# EAGLE schematic partybooth (EAGLE 6.1)
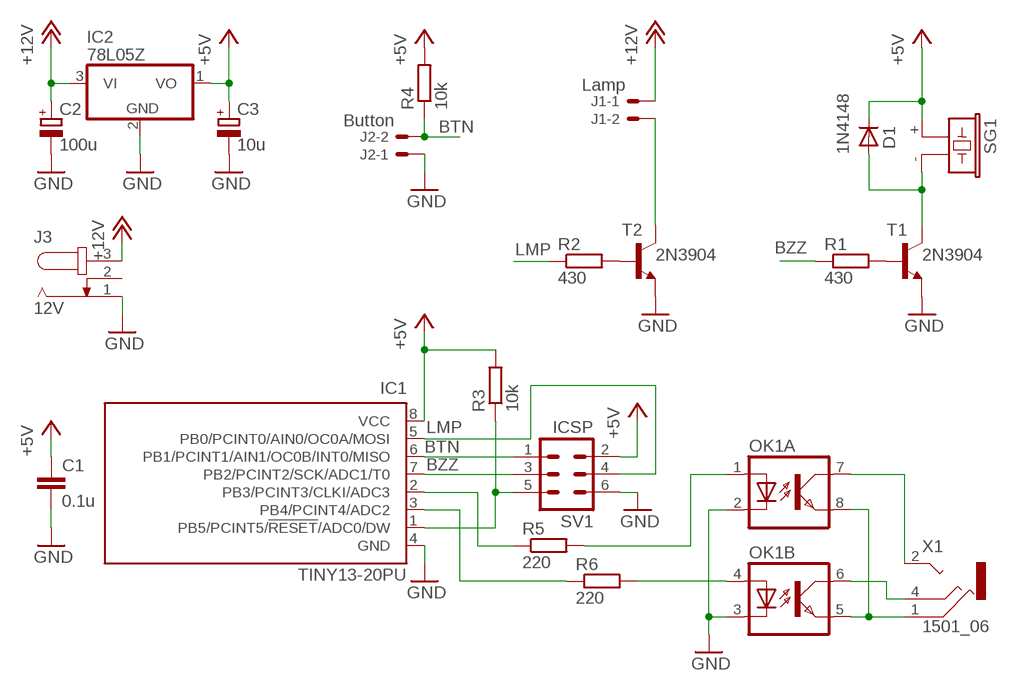
[diagram p0: schematic, sheet 1]

## Parts
C1  0.1u  C-EU050-025X075  [C050-025X075]
C2  100u  CPOL-EUB45181B  [B45181B]
C3  10u  CPOL-EUB45181B  [B45181B]
D1  1N4148  1N4148DO35-7  [DO35-7]
IC1  TINY13-20PU  [DIL08]
IC2  78L05Z  [TO92]
J1  Lamp  22-27-2021-02  [6410-02]
J2  Button  22-27-2021-02  [6410-02]
J3  12V  JACK-PLUG0  [SPC4077]
OK1  ILD2  [DIL08]
R1  430  R-EU_0204/7  [0204/7]
R2  430  R-EU_0204/7  [0204/7]
R3  10k  R-EU_0204/7  [0204/7]
R4  10k  R-EU_0204/7  [0204/7]
R5  220  R-EU_0204/7  [0204/7]
R6  220  R-EU_0204/7  [0204/7]
SG1  F/CM12P  [F/CM12P]
SV1  ICSP  MA03-2  [MA03-2]
T1  2N3904  [TO92]
T2  2N3904  [TO92]
X1  1501_06  [1501_06]

## Nets
+5V: C1.1 C3.+ D1.C IC1.8(VCC) IC2.1(VO) R3.2 R4.2 SG1.+ SV1.2
+12V: C2.+ IC2.3(VI) J1.1 J3.3
BTN: IC1.6(PB1/PCINT1/AIN1/OC0B/INT0/MISO) J2.2 R4.1 SV1.1
BZZ: IC1.7(PB2/PCINT2/SCK/ADC1/T0) R1.1 SV1.3
FOC: OK1.4(B:A) R6.2
GND: C1.2 C2.- C3.- IC1.4(GND) IC2.2(GND) J2.1 J3.1 OK1.2(A:C) OK1.3(B:C) SV1.6 T1.3(E) T2.3(E)
LMP: IC1.5(PB0/PCINT0/AIN0/OC0A/MOSI) R2.1 SV1.4
N$1: R1.2 T1.2(B)
N$2: D1.A SG1.- T1.1(C)
N$3: R2.2 T2.2(B)
N$4: J1.2 T2.1(C)
N$5: OK1.1(A:A) R5.2
N$6: IC1.1(PB5/PCINT5/!RESET!/ADC0/DW) R3.1 SV1.5
N$8: IC1.3(PB4/PCINT4/ADC2) R6.1
N$10: OK1.5(B:EMIT) OK1.8(A:EMIT) X1.1
N$11: OK1.6(B:COL) X1.4
N$12: OK1.7(A:COL) X1.2
SHT: IC1.2(PB3/PCINT3/CLKI/ADC3) R5.1
Unconnected: J3.2

## Library data of the parts
C1 = rcl:C-EU: CAPACITOR, European symbol
C2 C3 = rcl:CPOL-EU: POLARIZED CAPACITOR, European symbol
D1 = diode:1N4148: DIODE high speed (Philips)
IC1 = atmel:TINY13: 8-bit AVR Microcontroller with 1K Bytes In-System Programmable Flash Source: http://www.atmel.com/dyn/resources/prod_documents/2535S.pdf; MPN: ATTINY13-20PU; OC_FARNELL: 9171550; OC_NEWARK: 96K6521
IC2 = linear:78*: Positive VOLTAGE REGULATOR Source: http://cache.national.com/ds/LM/LM78L05.pdf http://www.fairchildsemi.com/ds/LM/LM7805.pdf
J1 J2 = con-molex:22-?-02: CONNECTOR wire to board 2.54 mm (.1 inch) pitch header; OC_FARNELL: unknown; OC_NEWARK: unknown
J3 = con-jack:JACK-PLUG: DC POWER JACK Power Jack, DC, Right Angle, Through Hole, Rated 5A at 16VDC, PC Terminals Distributor: Farnell (www.Farnell.de) Drawing: 84N1161.pdf / 84N1162.pdf Manufacturer: SPC Technology (www.spctechnology.com) Type: SPC4077 / SPC 4078; OC_FARNELL: unknown; OC_NEWARK: unknown
OK1 = optocoupler:ILD2: SIEMENS OPTO COUPLER; OC_FARNELL: 1469596; OC_NEWARK: unknown
R1-R6 = rcl:R-EU_: RESISTOR, European symbol
SG1 = buzzer:F/CM12P: BUZZER Source: Buerklin; OC_FARNELL: unknown; OC_NEWARK: unknown
SV1 = con-lstb:MA03-2: PIN HEADER; OC_FARNELL: unknown; OC_NEWARK: unknown
T1 T2 = transistor:2N3904: NPN TRANSISTOR
X1 = con-lumberg:1501_0*: Jack connectors according to JISC 6560, 2.5 mm Klinkensteckverbinder nach JISC 6560, 2,5 mm Source: http://www.lumberg.com/Produkte/PDFs/1501_05.pdfedit 1501_03 http://www.lumberg.com/Produkte/PDFs/1501_06.pdf; OC_FARNELL: 1308867; OC_NEWARK: unknown